# Altium schematic sheet Main.SchDoc: Контроллер батареи
size 420 x 297 mm; Date: 12.01.21; ApprovedBy: Корольков; CheckedBy: Ящера; Author: Шляков; DocumentNumber: ЛАЭ3.20.10.02.05.200 Э3; SheetNumber: 1; SheetTotal: 7; Letter1Column: O; Scale: 1:1; ProcessInspection: Евланов; Title2str: Beam BMS; DocumentType: Схема электрическая принципиальная
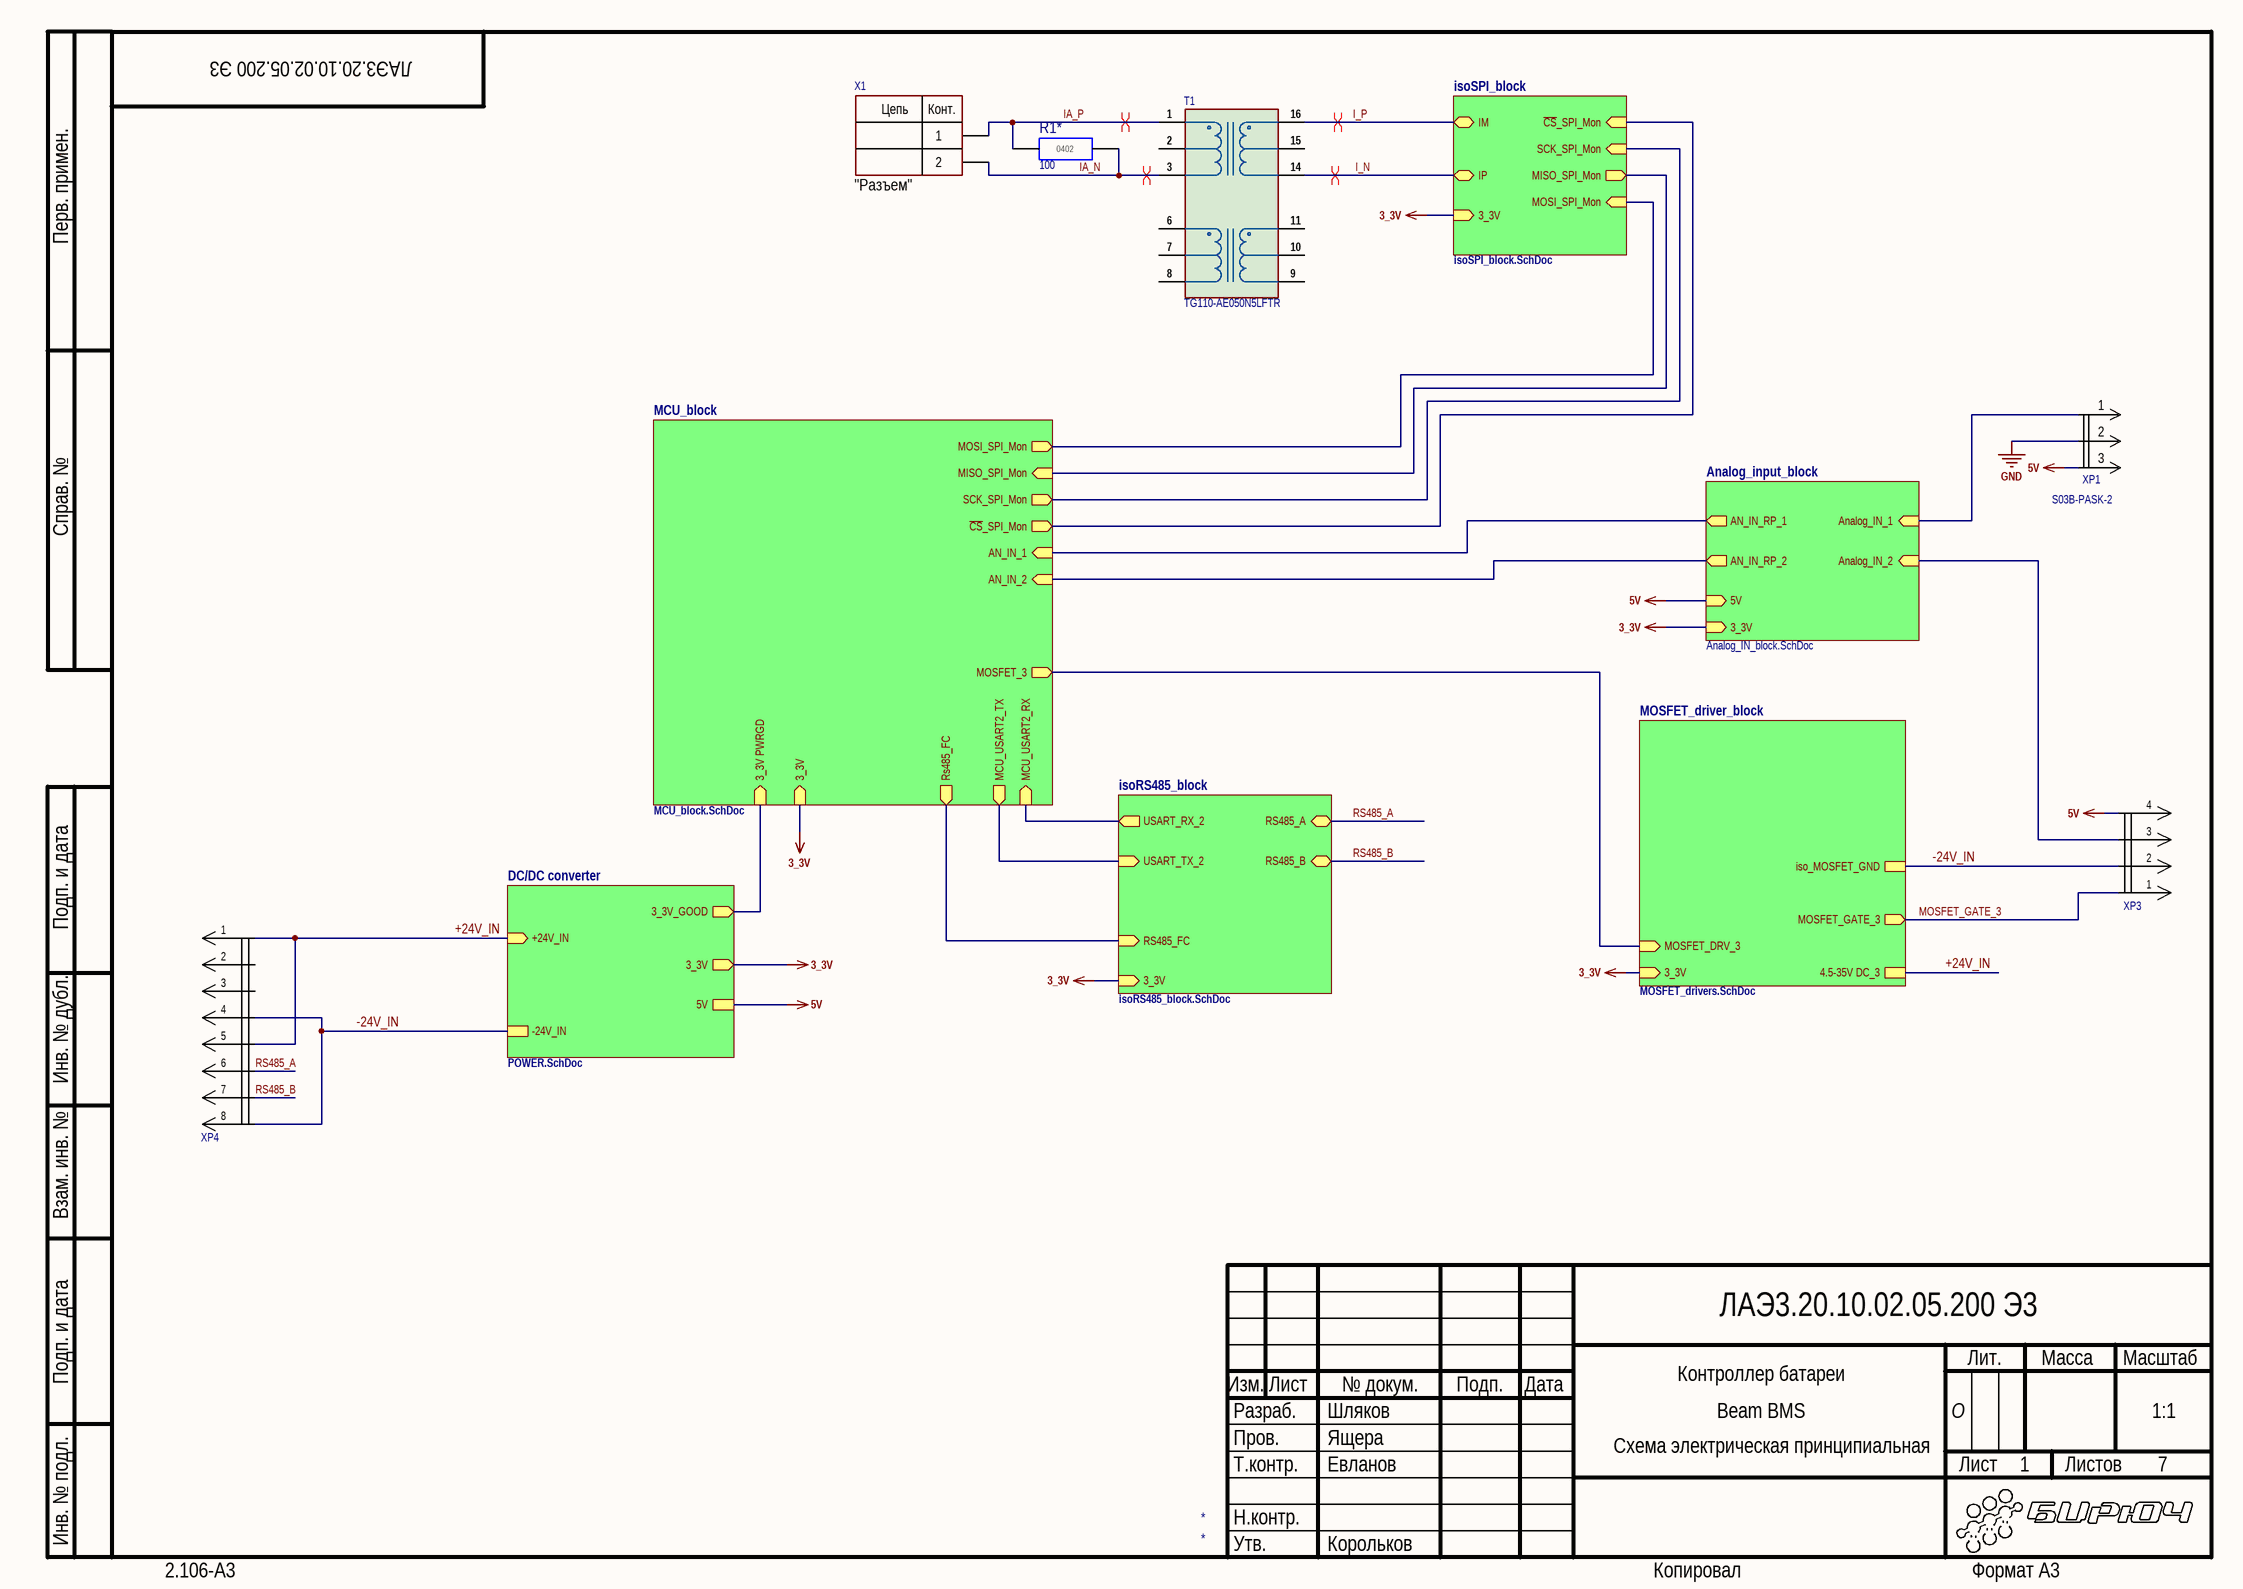
[diagram p0: Main.SchDoc]

## Parts
R1*  value 100  [CR0402(1005)]  (hidden comment: CR0402-100-±5%)
T1  TG110-AE050N5LFTR  [SMT4_SOIC16_N5]
X1  CommentText: "Разъем"  [MOLEX 1053131102]
XP1  S03B-PASK-2  [S03B-PASK-2]
XP3  1565749-3  [TE_1565749-3]  (value not drawn)
XP4  1-1379684-1  [TE_1379684-1]  (value not drawn)

## Sub-sheets
Analog_input_block = Analog_IN_block.SchDoc: AN_IN_RP_2 (out), Analog_IN_2 (in), 3_3V (in), AN_IN_RP_1 (out), Analog_IN_1 (in), 5V (in)
DC/DC converter = POWER.SchDoc: 5V, 3_3V_GOOD (out), 3_3V (out), +24V_IN (in), -24V_IN
isoRS485_block = isoRS485_block.SchDoc: 3_3V (in), RS485_FC (in), RS485_B (bidir), RS485_A (bidir), USART_RX_2 (out), USART_TX_2 (in)
isoSPI_block = isoSPI_block.SchDoc: ~{CS}_SPI_Mon (in), IM (bidir), SCK_SPI_Mon (in), MISO_SPI_Mon (out), MOSI_SPI_Mon (in), 3_3V (in), IP (bidir)
MCU_block = MCU_block.SchDoc: SCK_SPI_Mon (out), 3_3V (in), MISO_SPI_Mon (in), ~{CS}_SPI_Mon (out), MOSI_SPI_Mon (out), MCU_USART2_TX (out), MCU_USART2_RX (in), MOSFET_3 (out), 3_3V PWRGD (in), AN_IN_1 (in), AN_IN_2 (in), Rs485_FC (out)
MOSFET_driver_block = MOSFET_drivers.SchDoc: MOSFET_GATE_3 (out), MOSFET_DRV_3 (in), 3_3V (in), iso_MOSFET_GND, 4.5-35V DC_3

## Nets
3_3V: sheet isoSPI_block/3_3V, sheet DC/DC converter/3_3V, sheet MCU_block/3_3V, sheet isoRS485_block/3_3V, sheet MOSFET_driver_block/3_3V, sheet Analog_input_block/3_3V
5V: XP1.3 XP3.4 ; sheet DC/DC converter/5V, sheet Analog_input_block/5V
GND: XP1.2
+24V_IN: XP4.1 XP4.5 ; sheet DC/DC converter/+24V_IN, sheet MOSFET_driver_block/4.5-35V DC_3
-24V_IN: XP3.2 XP4.4 XP4.8 ; sheet DC/DC converter/-24V_IN, sheet MOSFET_driver_block/iso_MOSFET_GND
I_N: T1.14(S1_P) ; sheet isoSPI_block/IP
I_P: T1.16(S1_N) ; sheet isoSPI_block/IM
IA_N: R1*.2(-) T1.3(P1_2) X1.2
IA_P: R1*.1(+) T1.1(P1_1) X1.1
MOSFET_GATE_3: XP3.1 ; sheet MOSFET_driver_block/MOSFET_GATE_3
RS485_A: XP4.6 ; sheet isoRS485_block/RS485_A
RS485_B: XP4.7 ; sheet isoRS485_block/RS485_B
NetXP1_1: XP1.1 ; sheet Analog_input_block/Analog_IN_1
NetXP3_3: XP3.3 ; sheet Analog_input_block/Analog_IN_2
(unnamed): sheet isoSPI_block/~{CS}_SPI_Mon, sheet MCU_block/~{CS}_SPI_Mon
(unnamed): sheet isoSPI_block/SCK_SPI_Mon, sheet MCU_block/SCK_SPI_Mon
(unnamed): sheet isoSPI_block/MISO_SPI_Mon, sheet MCU_block/MISO_SPI_Mon
(unnamed): sheet isoSPI_block/MOSI_SPI_Mon, sheet MCU_block/MOSI_SPI_Mon
(unnamed): sheet DC/DC converter/3_3V_GOOD, sheet MCU_block/3_3V PWRGD
(unnamed): sheet MCU_block/MCU_USART2_TX, sheet isoRS485_block/USART_TX_2
(unnamed): sheet MCU_block/MCU_USART2_RX, sheet isoRS485_block/USART_RX_2
(unnamed): sheet MCU_block/MOSFET_3, sheet MOSFET_driver_block/MOSFET_DRV_3
(unnamed): sheet MCU_block/AN_IN_1, sheet Analog_input_block/AN_IN_RP_1
(unnamed): sheet MCU_block/AN_IN_2, sheet Analog_input_block/AN_IN_RP_2
(unnamed): sheet MCU_block/Rs485_FC, sheet isoRS485_block/RS485_FC

Not connected (* = marked no-connect by the designer): T1 2(P1_T) 4(NC@1) 5(NC@2) 6(P2_1) 7(P2_T) 8(P2_2) 9(S2_P) 10(S2_T) 11(S2_N) 12(NC@4) 13(NC@3) 15(S1_T); XP4 2 3

## Layout directives
differential pair: I_N, I_P, IA_N, IA_P

## Notes on the sheet
- Перв. примен.
- Справ. №
- Подп. и дата
- Инв. № дубл.
- Взам. инв. №
- Разраб.
- Изм.
- Лист
- № докум.
- Подп.
- Дата
- Лит.
- Масса
- Масштаб
- Пров.
- Т.контр.
- Листов
- Инв. № подл.
- Утв.
- Н.контр.
- 2.106-A3
- Копировал
- Формат А3
- (in symbol CR0402-#-±5%) 0402
- (in symbol Molex 1053131102) Цепь; Конт.

## Library data of the parts
R1* = CR0402-#-±5%: Чип резистор; Maximum Working Voltage: 50 В; TOLERANCE: 5%; Supplier 1: Digi-Key; Supplier Part Number 1: 311-10.0KLRDKR-ND
T1 = TG110-AE050N5LFTR: Halo's <b>TG110-AE050N5LFTR</b> ULTRA-Series, 16 Pin SOIC 10/100BASE-TX Magnetic Modules<br> <br> <b>Description:</b><br> <br>; Package: None; Price: None; Value: *; Availability: Unavailable; Supplier 1: Mouser; Supplier Part Number 1: 493-TG110-AE050N5LF; MP: TG110-AE050N5LFTR
X1 = Molex 1053131102: Manufacturer: Molex; ValueManufacturerPartNumber: Connector, 2pin, 2.5mm, 1500VDC, 6.5A; TypeConnector: Connector; VoltageMax: 1500VDC; Pitch: 2.5mm; CurrentMax: 6.5A; Multichannel: 2pin; PartNumber: 1053131102
XP1 = S03B-PASK-2: Вилка угловая выводная, шаг 2мм; Manifacturing: JST; PN: JST S03B-PASK-2(LF)(SN); Supplier 1: Newark; Supplier Part Number 1: 90R9294
XP3 = TE-1565749-3: TH/.025 Connector System, Automotive Headers, 4 Position, 2.2mm [.087in] Centerline, Horizontal, 1 Row, Gray, Through Hole - Solder, Tin (Sn); Manufacturer: TE Connectivity; PartNumber: 1565749-3; Type: Automotive, for PCB; PCB Mount Orientation: Horizontal; Color: Gray; Temperature: -40...+100 C; Series: TH/.025
XP4 = TE-1379684-1: TH/.025 Connector System, Automotive Headers, 8 Position, 2.2mm [.087in] Centerline, Horizontal, 2 Row, Black, Through Hole - Solder, Tin (Sn); Manufacturer: TE Connectivity; PartNumber: 1-1379684-1; Type: Automotive, for PCB; PCB Mount Orientation: Horizontal; Color: Black!!!; Temperature: -40...+100 C; Series: TH/.025